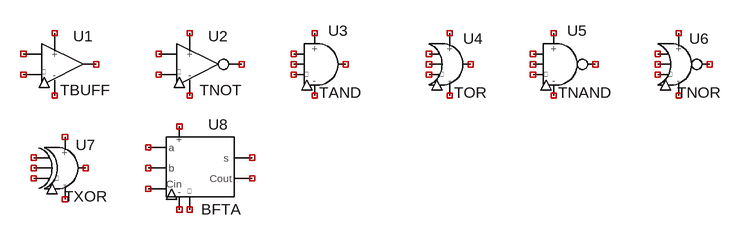
[diagram p0: schematic list.asc]
list.asc, the LTspice schematic file:
Version 4
SHEET 1 880 680
SYMBOL TBUFF -144 112 R0
SYMATTR InstName U1
SYMBOL TNOT 64 112 R0
SYMATTR InstName U2
SYMBOL TAND 256 112 R0
SYMATTR InstName U3
SYMBOL TOR 448 112 R0
SYMATTR InstName U4
SYMBOL TNAND 624 112 R0
SYMATTR InstName U5
SYMBOL TNOR 800 112 R0
SYMATTR InstName U6
SYMBOL TXOR -144 272 R0
SYMATTR InstName U7
SYMBOL BFTA 64 272 R0
SYMATTR InstName U8

The netlist it stands for:
* list.asc
XU1 NC_01 NC_02 NC_03 NC_04 NC_05 TBUFF  ; pins in vcc vee out gnd
XU2 NC_06 NC_07 NC_08 NC_09 NC_10 TNOT  ; pins in vcc vee out gnd
XU3 NC_11 NC_12 NC_13 NC_14 NC_15 NC_16 TAND  ; pins a b vcc vee out gnd
XU4 NC_17 NC_18 NC_19 NC_20 NC_21 NC_22 TOR  ; pins a b vcc vee out gnd
XU5 NC_23 NC_24 NC_25 NC_26 NC_27 NC_28 TNAND  ; pins a b vcc vee out gnd
XU6 NC_29 NC_30 NC_31 NC_32 NC_33 NC_34 TNOR  ; pins a b vcc vee out gnd
XU7 NC_35 NC_36 NC_37 NC_38 NC_39 NC_40 TXOR  ; pins a b vcc vee out gnd
XU8 NC_41 NC_42 NC_43 NC_44 NC_45 NC_46 NC_47 NC_48 BFTA  ; pins a b vcc vee cin cout s gnd
.lib /Users/manoelribeiroalmeida/dev/trit/LTspice/TBUFF.sub
.lib /Users/manoelribeiroalmeida/dev/trit/LTspice/TNOT.sub
.lib /Users/manoelribeiroalmeida/dev/trit/LTspice/TAND.sub
.lib /Users/manoelribeiroalmeida/dev/trit/LTspice/TOR.sub
.lib /Users/manoelribeiroalmeida/dev/trit/LTspice/TNAND.sub
.lib /Users/manoelribeiroalmeida/dev/trit/LTspice/TNOR.sub
.lib /Users/manoelribeiroalmeida/dev/trit/LTspice/TXOR.sub
.lib /Users/manoelribeiroalmeida/dev/trit/LTspice/BFTA.sub
.backanno
.end